# EAGLE design shaker (EAGLE 9.6.2)
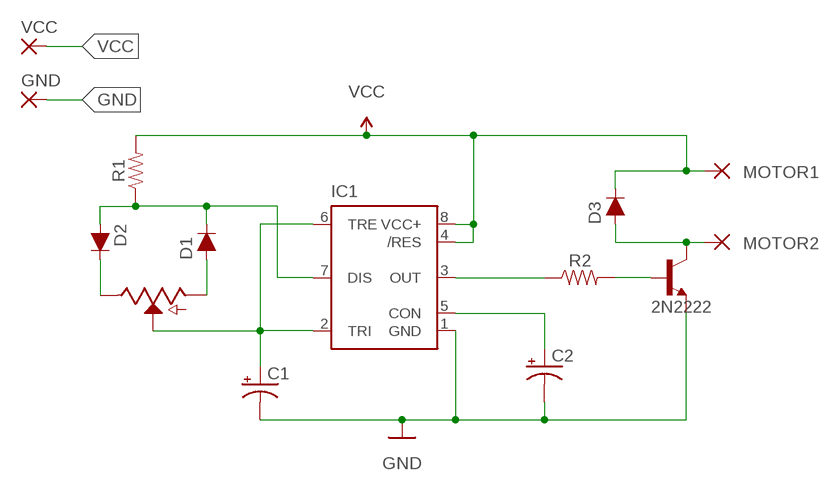
[diagram p0: schematic, sheet 1]

## Parts
2N2222  200mA/40V  TRANS_NPN2N2222  [TO-92]
C1  CAPACITOR_5MM  [CAPPRD508W65D500H1100B]
C2  100nF  CAPACITOR_5MM  [CAPPRD508W65D500H1100B]
D1  DIODEDEFAULT  [DIODE]
D2  DIODEDEFAULT  [DIODE]
D3  DIODEDEFAULT  [DIODE]
GND  3,81/1,4  [3,81/1,4]
IC1  555  555TEXAS_INSTRUMENTS  [DIP8]
MOTOR1  3,81/1,4  [3,81/1,4]
MOTOR2  3,81/1,4  [3,81/1,4]
R1  RESISTORDEFAULT  [RESISTOR]
R2  1k  RESISTORDEFAULT  [RESISTOR]
VCC  3,81/1,4  [3,81/1,4]
VR1  10k  POTENTIOMETERDEFAULT  [POTENTIOMETER]

## Nets
CON: C2.1(+) IC1.5(CON)
DIS: D1.CATHODE(C) D2.ANODE(A) IC1.7(DIS) R1.1
GND: 2N2222.1(E) C1.2(-) C2.2(-) GND.1(P) IC1.1(GND)
MOTOR2: 2N2222.3(C) D3.ANODE(A) MOTOR2.1(P)
N$1: 2N2222.2(B) R2.2
N$2: D2.CATHODE(C) VR1.B(E)
N$3: D1.ANODE(A) VR1.A
OUT: IC1.3(OUT) R2.1
TRI: C1.1(+) IC1.2(TRI) IC1.6(TRE) VR1.C(CENTER)
VCC: D3.CATHODE(C) IC1.4(/RES) IC1.8(VCC+) MOTOR1.1(P) R1.2 VCC.1(P)

## Library data of the parts
2N2222 = my-lib:TRANS_NPN: NPN transistor; PROD_ID: TRANS-08447
C1 C2 = my-lib:CAPACITOR: 1,000µF/1mF ceramic capacitors A capacitor is a passive two-terminal electrical component used to store electrical energy temporarily in an electric field. CAP-08070
D1-D3 = my-lib:DIODE: Diode These are standard reverse protection diodes and small signal diodes. SparkFun Products: SparkFun SparkPunk Sound Kit <https://www.sparkfun.com/products/11177> SparkFun ESP8266 Thing <https://www.sparkfun.com/products/13231>
GND MOTOR1 MOTOR2 VCC = wirepad:3,81/1,4: THROUGH-HOLE PAD
IC1 = my-lib:555: General purpose bipolar Timer Datasheet <http://www.sparkfun.com/datasheets/Components/General/ne555.pdf> SparkFun Products SparkFun SparkPunk Sequencer Kit <https://www.sparkfun.com/products/12707> (KIT-12707) Storefront Component: 555 Timer <https://www.sparkfun.com/products/9273> (COM-09273) Two parts valid for production: VFP: IC-11930 (M7555 PTH) VFP: IC-09173 (555 PTH) - Preferred
R1 R2 = my-lib:RESISTOR
VR1 = my-lib:POTENTIOMETER

## Board
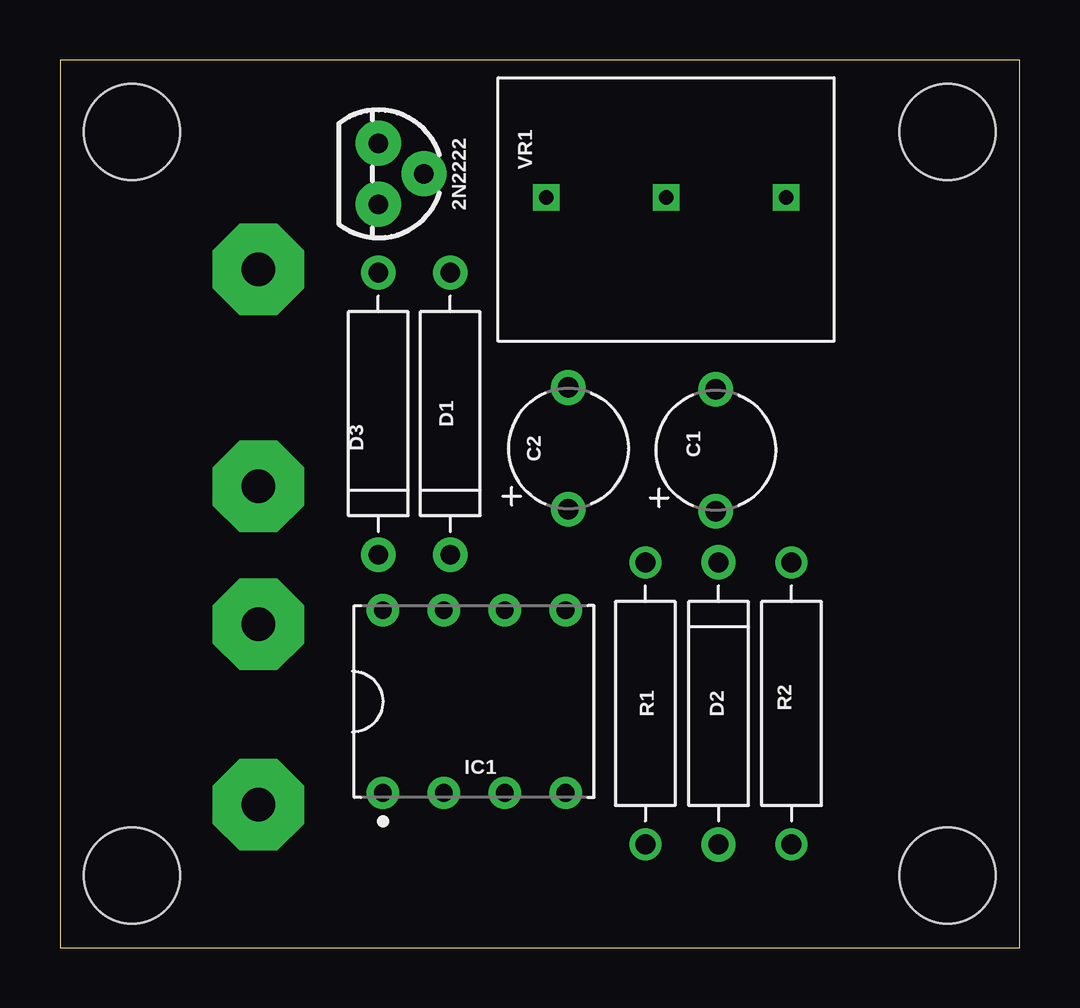
[diagram p1: board, top side]
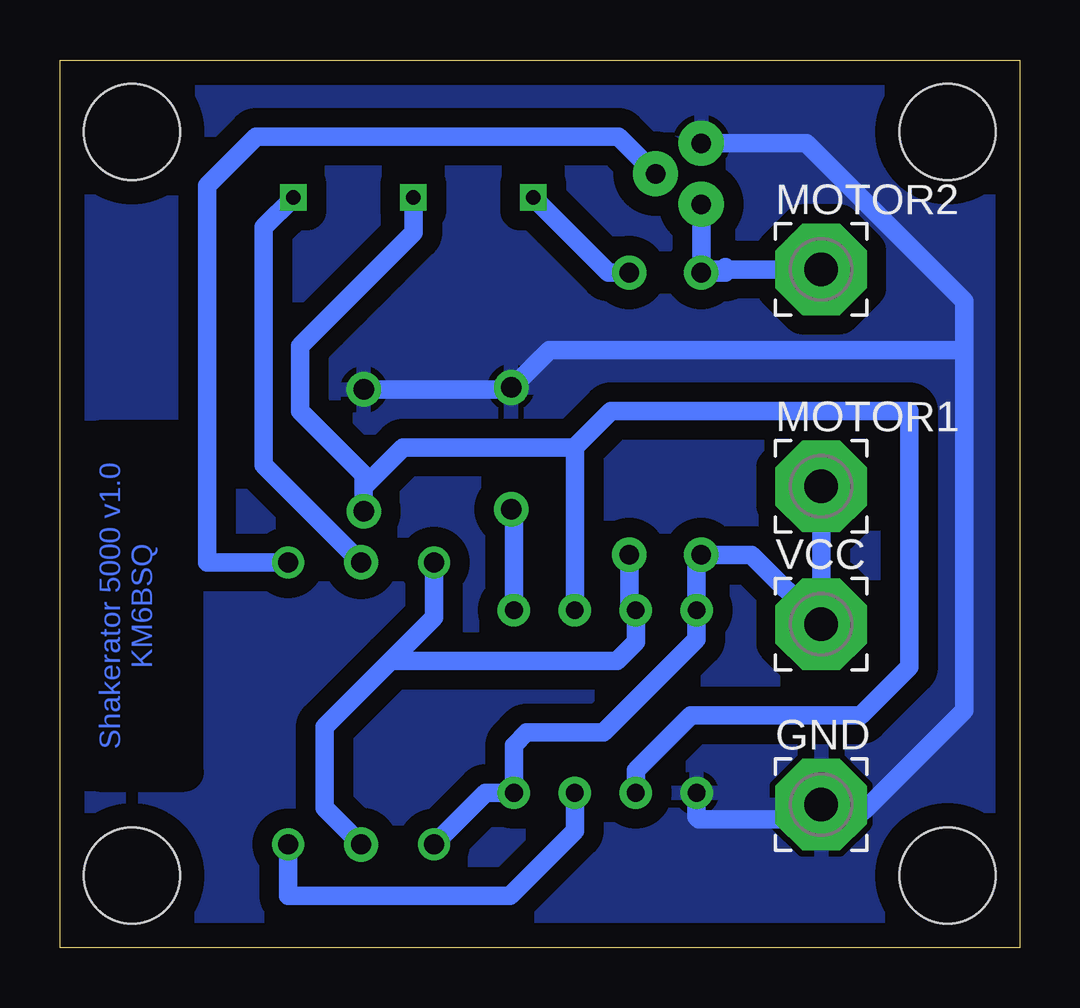
[diagram p2: board, bottom side, seen from below]

Size 40 x 37 mm. Coordinates in mm from the lower left corner, seen from the top.
Outline: 0,0 40,0 40,37 0,37 0,0
Copper layers (1*16): Top 0.035mm / dielectric 1.5mm / Bottom 0.035mm
Design rules "my-default": minimum track width 20mil, minimum drill 0.35mm, track to track 10mil, track to pad 10mil, pad to pad 10mil, via to via 10mil, smd to smd 6mil, copper to edge 40mil, drill to drill 6mil, minimum pad ring 10mil, minimum via ring 8mil, stop-mask expansion 4mil, vias tented up to drill 0mil, thermal gap 10mil
Holes 4 mm at 3,3 3,34 37,3 37,34

### Footprints (pad centres in the part's own frame; a part is rotated, then mirrored left to right if it is on the bottom)
TO-92 = drill 0.813 pad 1.88: 1 -1.27,0; 2 0,1.905; 3 1.27,0
CAPPRD508W65D500H1100B = drill 0.85 pad 1.45: 1 -2.54,0; 2 2.54,0
DIODE = drill 0.83 pad 1.43: ANODE 5.88,0; CATHODE -5.88,0
3,81/1,4 = drill 1.397 pad 3.81 octagon: 1 0,0
DIP8 = drill 0.743 pad 1.343: 1 -3.81,3.81; 2 -3.81,1.27; 3 -3.81,-1.27; 4 -3.81,-3.81; 5 3.81,-3.81; 6 3.81,-1.27; 7 3.81,1.27; 8 3.81,3.81
RESISTOR = drill 0.83: 1 -5.88,0; 2 5.88,0
POTENTIOMETER = drill 0.6 square: A -5,-2; B 5,-2; C 0,-2

### Placement (x,y rotation side)
2N2222  13.27,32.25 270 top
C1  27.33,20.73 90 top
C2  21.19,20.81 90 top
D1  16.27,22.25 90 top
D2  27.45,10.18 270 top
D3  13.27,22.25 90 top
GND  8.27,5.95 0 bottom
IC1  17.27,10.25 90 top
MOTOR1  8.27,19.22 0 bottom
MOTOR2  8.27,28.27 0 bottom
R1  24.4,10.18 270 top
R2  30.5,10.18 90 top
VCC  8.27,13.48 0 bottom
VR1  25.27,33.27 0 top

### Tracks (layer width: path | path; a pad name or v marks a point on that pad's centre or on a via)
CON
  Bottom 0.762: C2.1 21.08,18.16 IC1.5
DIS
  Bottom 0.762: D1.CATHODE 16.27,14.33 IC1.7 16,12.73 16.78,11.95 26.18,11.95 26.18,11.99 | R1.1 24.4,13.77 26.18,11.99 | D2.ANODE 28.97,5.82 28.97,9.2 26.18,11.99
GND
  Bottom 0.762: IC1.1 13.46,5.44 13.37,5.35 8.4,5.35 8.4,5.82 GND.1 8.02,5.7 6.49,5.7 2.3,9.89 2.3,24.91 | 2.3,24.91 2.3,26.94 8.89,33.52 2N2222.1 | 2.3,24.91 19.6,24.91 21.24,23.27 C1.2 21.27,23.27 C2.2
  pour Bottom (isolate 0.813): 0.78,36.34 0.78,0.78 39.39,0.78 39.39,36.34
MOTOR2
  Bottom 0.762: MOTOR2.1 8.29,28.25 12.15,28.25 | 12.15,28.25 13.27,28.25 2N2222.3 | 12.15,28.25 12.27,28.13 D3.ANODE | 12.27,28.37 12.15,28.25
N$1
  Bottom 0.762: 2N2222.2 16.72,33.8 31.83,33.8 33.86,31.77 33.86,16.06 R2.2
N$2
  Bottom 0.762: VR1.B 31.51,30.03 31.51,20.12 D2.CATHODE
N$3
  Bottom 0.762: VR1.A 17.13,28.13 D1.ANODE
OUT
  Bottom 0.762: R2.1 30.5,2.16 21.24,2.16 18.54,4.86 IC1.3
TRI
  Bottom 0.762: 18.54,20.84 18.54,18.57 IC1.6 | 18.54,20.84 18.54,20.86 17.03,22.37 4.59,22.37 4.59,11.7 6.62,9.67 13.71,9.67 16,7.38 IC1.2 | 18.54,20.84 25.7,20.84 27.33,19.21 C1.1 27.33,19.71 29.99,22.37 29.99,25.08 25.27,29.8 VR1.C
VCC
  Bottom 0.762: MOTOR1.1 VCC.1 11.17,16.37 D3.CATHODE 13.46,16.18 IC1.8 13.46,12.85 17.33,8.97 20.54,8.97 21.08,8.44 IC1.4 22.25,6.44 R1.2

### Text on the board
Bottom: Shakerator 5000 v1.0 / KM6BSQ